# Altium schematic sheet MAIN.SchDoc
size A4
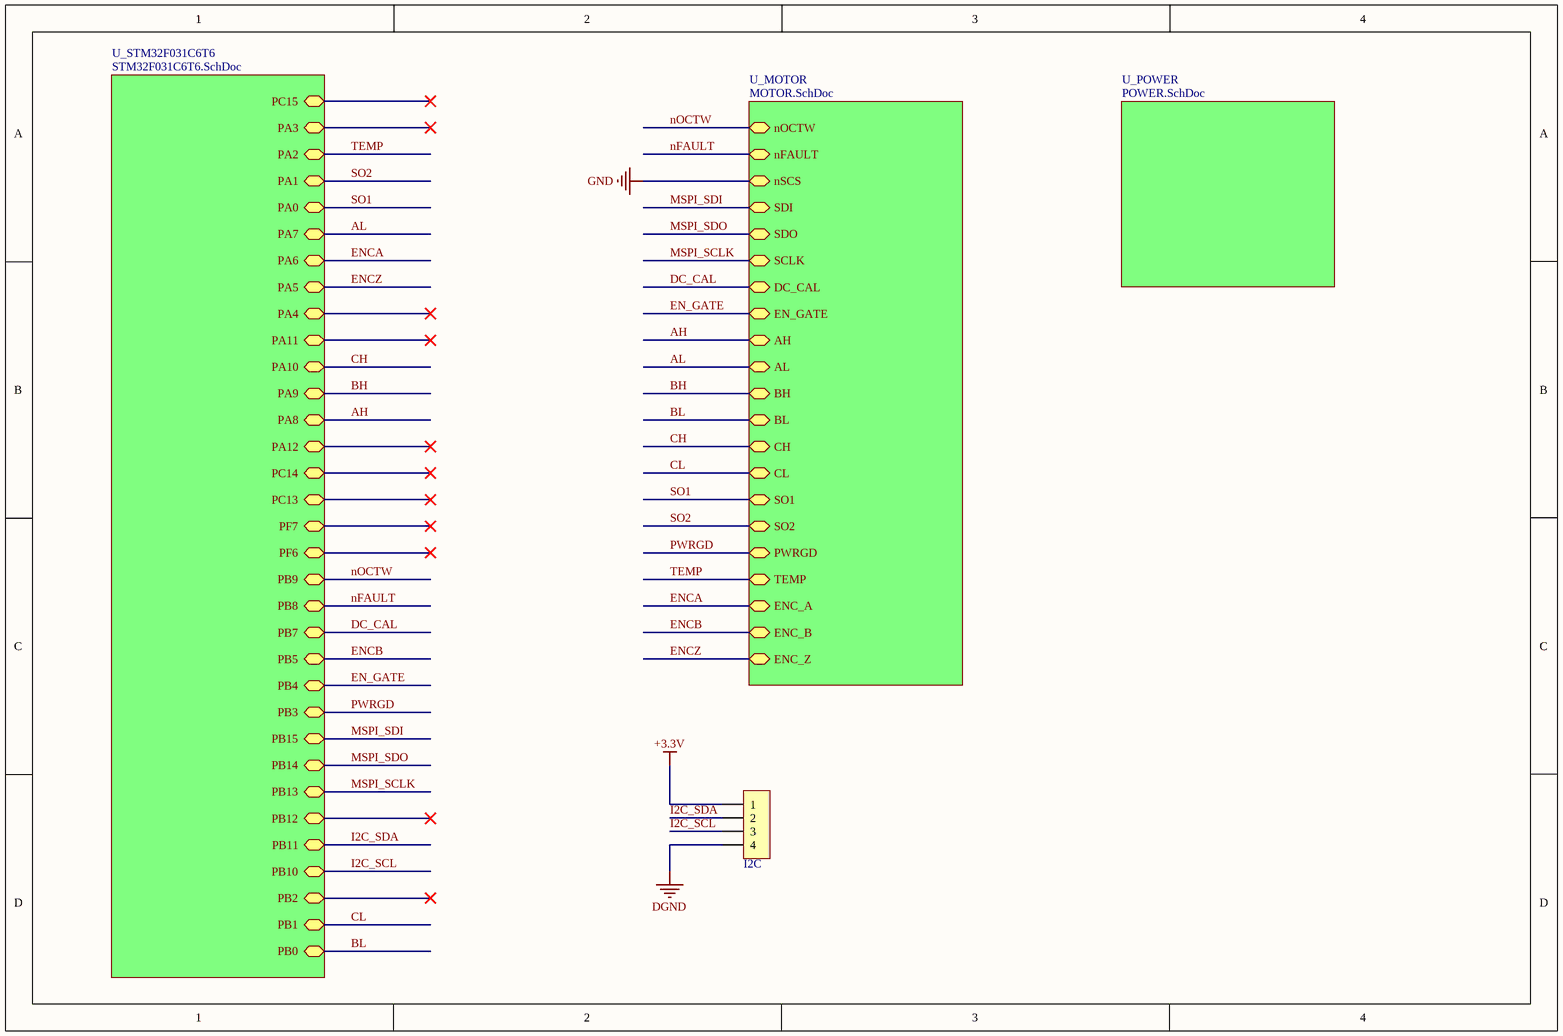
[diagram p0: MAIN.SchDoc]

## Parts
I2C  HDR-1X4  [ZH1.5-WS-4P]  (value not drawn)

## Sub-sheets
U_MOTOR = MOTOR.SchDoc: nOCTW (bidir), nFAULT (bidir), nSCS (bidir), SDI (bidir), SDO (bidir), SCLK (bidir), DC_CAL (bidir), EN_GATE (bidir), AH (bidir), AL (bidir), BH (bidir), BL (bidir), CH (bidir), CL (bidir), SO1 (bidir), SO2 (bidir), PWRGD (bidir), TEMP (bidir), ENC_A (bidir), ENC_B (bidir), ENC_Z (bidir)
U_POWER = POWER.SchDoc: no entries
U_STM32F031C6T6 = STM32F031C6T6.SchDoc: PB0 (bidir), PB1 (bidir), PB2 (bidir), PB10 (bidir), PB11 (bidir), PB12 (bidir), PB13 (bidir), PB14 (bidir), PB15 (bidir), PB3 (bidir), PB4 (bidir), PB5 (bidir), PB7 (bidir), PB8 (bidir), PB9 (bidir), PF6 (bidir), PF7 (bidir), PC13 (bidir), PC14 (bidir), PA12 (bidir), PA8 (bidir), PA9 (bidir), PA10 (bidir), PA11 (bidir), PA4 (bidir), PA5 (bidir), PA6 (bidir), PA7 (bidir), PA0 (bidir), PA1 (bidir), PA2 (bidir), PA3 (bidir), PC15 (bidir)

## Nets
+3.3V: I2C.1
DGND: I2C.4
GND: sheet U_MOTOR/nSCS
AH: sheet U_MOTOR/AH, sheet U_STM32F031C6T6/PA8
AL: sheet U_MOTOR/AL, sheet U_STM32F031C6T6/PA7
BH: sheet U_MOTOR/BH, sheet U_STM32F031C6T6/PA9
BL: sheet U_MOTOR/BL, sheet U_STM32F031C6T6/PB0
CH: sheet U_MOTOR/CH, sheet U_STM32F031C6T6/PA10
CL: sheet U_MOTOR/CL, sheet U_STM32F031C6T6/PB1
DC_CAL: sheet U_MOTOR/DC_CAL, sheet U_STM32F031C6T6/PB7
EN_GATE: sheet U_MOTOR/EN_GATE, sheet U_STM32F031C6T6/PB4
ENCA: sheet U_MOTOR/ENC_A, sheet U_STM32F031C6T6/PA6
ENCB: sheet U_MOTOR/ENC_B, sheet U_STM32F031C6T6/PB5
ENCZ: sheet U_MOTOR/ENC_Z, sheet U_STM32F031C6T6/PA5
I2C_SCL: I2C.3 ; sheet U_STM32F031C6T6/PB10
I2C_SDA: I2C.2 ; sheet U_STM32F031C6T6/PB11
MSPI_SCLK: sheet U_MOTOR/SCLK, sheet U_STM32F031C6T6/PB13
MSPI_SDI: sheet U_MOTOR/SDI, sheet U_STM32F031C6T6/PB15
MSPI_SDO: sheet U_MOTOR/SDO, sheet U_STM32F031C6T6/PB14
nFAULT: sheet U_MOTOR/nFAULT, sheet U_STM32F031C6T6/PB8
nOCTW: sheet U_MOTOR/nOCTW, sheet U_STM32F031C6T6/PB9
PWRGD: sheet U_MOTOR/PWRGD, sheet U_STM32F031C6T6/PB3
SO1: sheet U_MOTOR/SO1, sheet U_STM32F031C6T6/PA0
SO2: sheet U_MOTOR/SO2, sheet U_STM32F031C6T6/PA1
TEMP: sheet U_MOTOR/TEMP, sheet U_STM32F031C6T6/PA2

## Library data of the parts
I2C = Header 4: 4P接插件; 联系卖家，免费查找封装: 唯一出售店铺网址https://shop463601444.taobao.com; BOM名称: 4P接插件